# EAGLE design Sensor (EAGLE 7.7.0)
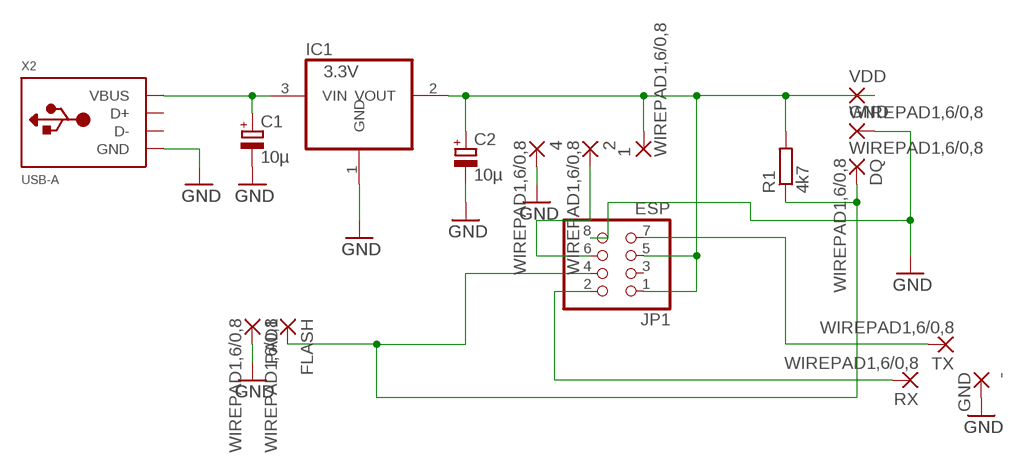
[diagram p0: schematic, sheet 1]

## Parts
1  WIREPAD1,6/0,8  [1,6/0,8]
2  WIREPAD1,6/0,8  [1,6/0,8]
4  WIREPAD1,6/0,8  [1,6/0,8]
-  GND  WIREPAD1,6/0,8  [1,6/0,8]
C1  10µ  CPOL-EUA/3216-18W  [A/3216-18W]
C2  10µ  CPOL-EUA/3216-18W  [A/3216-18W]
DQ  WIREPAD1,6/0,8  [1,6/0,8]
FLASH  WIREPAD1,6/0,8  [1,6/0,8]
GND  WIREPAD1,6/0,8  [1,6/0,8]
IC1  3.3V  REG1117  [SOT223]
JP1  ESP  PINHD-2X4  [2X04]
PAD1  WIREPAD1,6/0,8  [1,6/0,8]
R1  4k7  R-EU_R1206  [R1206]
RX  WIREPAD1,6/0,8  [1,6/0,8]
TX  WIREPAD1,6/0,8  [1,6/0,8]
VDD  WIREPAD1,6/0,8  [1,6/0,8]
X2  USB-A  [MOLEX_480371000]

## Nets
3V3: 1.1(P) C2.+ IC1.2(VOUT) JP1.1 JP1.5 R1.2 VDD.1(P)
GND: 4.1(P) -.1(P) C1.- C2.- GND.1(P) IC1.1(GND) JP1.8 PAD1.1(P) X2.4(GND)
GPIO0: DQ.1(P) FLASH.1(P) JP1.4 R1.1
GPIO2: 2.1(P) JP1.6
RX: JP1.2 RX.1(P)
TX: JP1.7 TX.1(P)
VBUS: C1.+ IC1.3(VIN) X2.1(VBUS)
Unconnected: JP1.3 X2.2(D-) X2.3(D+)

## Library data of the parts
1 2 4 - DQ FLASH GND PAD1 RX TX VDD = wirepad:WIREPAD: Wire PAD connect wire on PCB
C1 C2 = rcl:CPOL-EU: POLARIZED CAPACITOR, European symbol
IC1 = burr-brown:REG1117: 800mA and 1A Low Dropout (LDO) Positive Regulator 1.8V, 2.5V, 2.85V, 3.3V, 5V, and Adj; MPN: REG1117; OC_FARNELL: 1097566; OC_NEWARK: 14P6981
JP1 = pinhead:PINHD-2X4: PIN HEADER
R1 = rcl:R-EU_: RESISTOR, European symbol
X2 = adafruit:USB-A: USB type A 'plug' Used for things that can directly connect to a USB port, say USB key

## Board
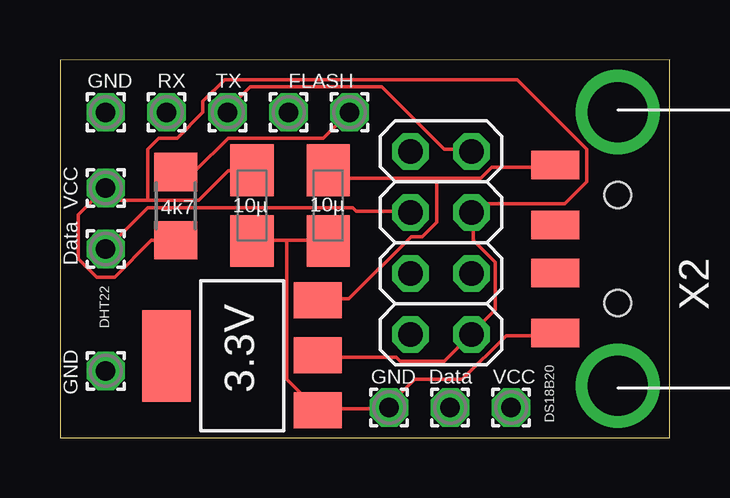
[diagram p1: board, top side]
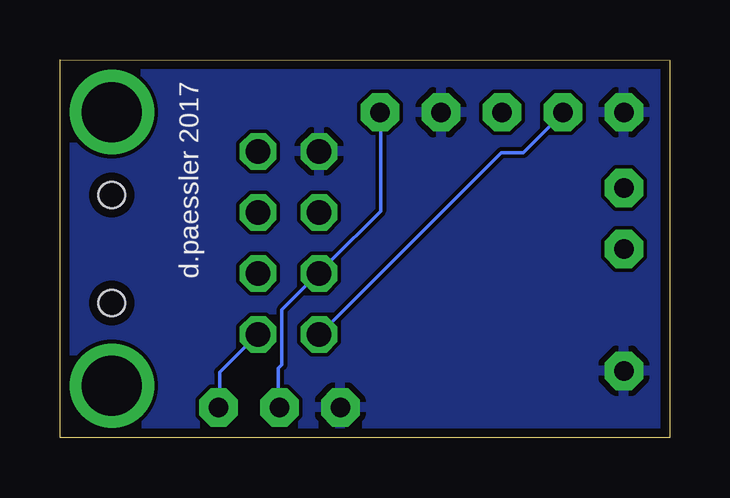
[diagram p2: board, bottom side, seen from below]

Size 25.4 x 15.75 mm. Coordinates in mm from the lower left corner, seen from the top.
Outline: 0,0 25.4,0 25.4,15.75 0,15.74 0,0
Copper layers (1*16): Top 0.0356mm / dielectric 1.5011mm / Bottom 0.0356mm
Design rules "LaenPCBOrder": minimum track width 6mil, minimum drill 13mil, track to track 6mil, track to pad 6mil, pad to pad 6mil, via to via 6mil, smd to smd 6mil, copper to edge 15mil, drill to drill 6mil, minimum pad ring 7mil, minimum via ring 7mil, stop-mask expansion 3mil, vias tented up to drill 0mil, thermal gap 10mil

### Footprints (pad centres in the part's own frame; a part is rotated, then mirrored left to right if it is on the bottom)
1,6/0,8 = drill 0.813 pad 1.6 octagon: 1 0,0
A/3216-18W = smd 2.15 x 1.8: + 1.475,0; - -1.475,0
SOT223 = smd 1.499 x 2.007: 1 -2.261,-3.15; 2 0.025,-3.15; 3 2.311,-3.15 | smd 3.81 x 2.007: 4 0,3.15
2X04 = drill 1.016 octagon: 1 -3.81,-1.27; 2 -3.81,1.27; 3 -1.27,-1.27; 4 -1.27,1.27; 5 1.27,-1.27; 6 1.27,1.27; 7 3.81,-1.27; 8 3.81,1.27
R1206 = smd 1.6 x 1.803: 1 -1.422,0; 2 1.422,0
MOLEX_480371000 = smd 1.2 x 2: 1 3.5,2.6; 2 1,2.6; 3 -1,2.6; 4 -3.5,2.6 | drill 2.5: M1 -5.7,0; M2 5.7,0 | hole 1.1: -2.25,0; 2.25,0

### Placement (x,y rotation side)
1  1.91,10.41 0 top
2  1.91,7.87 0 top
4  13.72,1.27 0 top
-  1.91,13.57 0 top
C1  11.18,9.68 90 top
C2  8,9.68 90 top
DQ  16.26,1.27 0 top
FLASH  12.06,13.57 0 top
GND  1.91,2.79 0 top
IC1  7.59,3.42 90 top
JP1  15.88,8.13 90 top
PAD1  9.53,13.57 0 top
R1  4.83,9.66 270 top
RX  4.45,13.57 0 top
TX  6.99,13.57 0 top
VDD  18.8,1.27 0 top
X2  23.24,7.87 90 top

### Tracks (layer width: path | path; a pad name or v marks a point on that pad's centre or on a via)
3V3
  Top 0.152: R1.2 4.72,8.23 3.81,8.23 2.29,6.71 1.52,6.71 0.76,7.47 0.76,9.3 1.83,10.36 1.1 1.98,10.36 2.44,9.91 3.66,9.91 | 3.66,9.91 5.79,9.91 7.01,11.12 7.92,11.12 C2.+ | IC1.2 10.82,3.35 14.02,3.35 14.17,3.2 16,3.2 17.07,4.27 JP1.1 17.22,4.42 18.14,5.33 18.14,7.32 17.22,8.23 17.22,9.3 JP1.5 17.22,9.45 17.53,9.75 21.03,9.75 21.95,10.67 21.95,12.04 19.05,14.94 6.86,14.94 5.94,14.02 5.94,13.56 4.88,12.5 4.12,12.5 3.66,12.04 3.66,9.91
  Bottom 0.152: VDD.1 18.75,1.37 18.75,2.74 17.22,4.27 JP1.1
GND
  Top 0.152: 9.45,8.23 11.12,8.23 C1.- | 9.45,8.23 8.08,8.23 C2.- | X2.4 20.57,4.27 18.59,4.27 16.76,2.44 14.78,2.44 13.72,1.37 4.1 13.72,1.22 10.82,1.22 IC1.1 10.67,1.22 9.45,2.44 9.45,8.23
  pour Bottom: 0,15.75 25.4,15.75 25.53,0 0,0
GPIO0
  Top 0.152: R1.1 4.88,11.12 5.64,11.12 7.01,12.5 10.97,12.5 12.04,13.56 FLASH.1
  Bottom 0.152: FLASH.1 12.04,13.56 12.04,9.45 14.17,7.32 14.17,7.16 14.48,6.86 JP1.4 14.63,6.86 16.15,5.33 16.15,3.05 16.31,2.9 16.31,1.37 DQ.1
GPIO2
  Top 0.152: JP1.6 14.48,9.45 12.34,9.45 12.19,9.6 3.66,9.6 1.98,7.92 2.1
RX
  Bottom 0.152: JP1.2 14.48,4.42 7.01,11.89 6.1,11.89 4.42,13.56 RX.1
TX
  Top 0.152: JP1.7 17.07,12.04 16,12.04 13.41,14.63 7.92,14.63 7.01,13.72 TX.1
VBUS
  Top 0.152: 15.7,10.82 11.58,10.82 11.28,11.12 C1.+ | 15.7,10.82 17.53,10.82 17.98,11.28 20.57,11.28 X2.1 | 15.7,10.82 15.7,8.99 15.09,8.38 14.63,8.38 12.04,5.79 10.82,5.79 IC1.3

### Text on the board
tPlace: GND | RX | TX | VCC | Data | DHT22 | GND | DS18B20 | GND | Data | VCC
bPlace: d.paessler 2017